# Altium schematic sheet Sample_FFC_Con_Sensor_v1.SchDoc
size A3; SheetNumber: 4; SheetTotal: 5
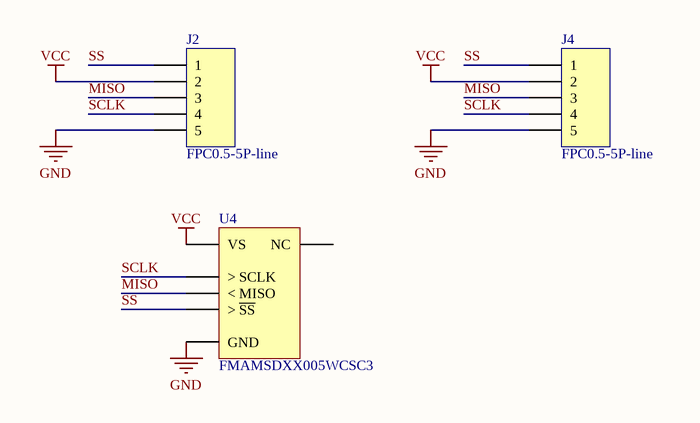
[diagram p0: Sample_FFC_Con_Sensor_v1.SchDoc]

## Parts
J2  FPC0.5-5P-line  [FPC0.5-5P-Line]
J4  FPC0.5-5P-line  [FPC0.5-5P-Line]
U4  FMAMSDXX005WCSC3  [FMA_MICROFORCE_6-EXTENED]

## Nets
GND: J2.5 J4.5 U4.3(GND)
VCC: J2.2 J4.2 U4.1(VS)
MISO: J2.3 J4.3 U4.5(<_MISO)
SCLK: J2.4 J4.4 U4.4(>_SCLK)
SS: J2.1 J4.1 U4.2(>_~{SS})

Not connected (* = marked no-connect by the designer): U4 6(NC)

## Library data of the parts
U4 = FMAMSDXX005WCSC3: Force Range: 5N / Output: SPI / FMA Series Force Sensor, compensated/amplified, mechanically / coupled, sphere contact element, sensor short and open / diagnostics, 5 N force range, compression force type, SPI digital / output, 20% to 80% transfer function, 3.3 V ±10% supply voltage